# Altium project MB1261.PrjPcb (part 1 of 3)
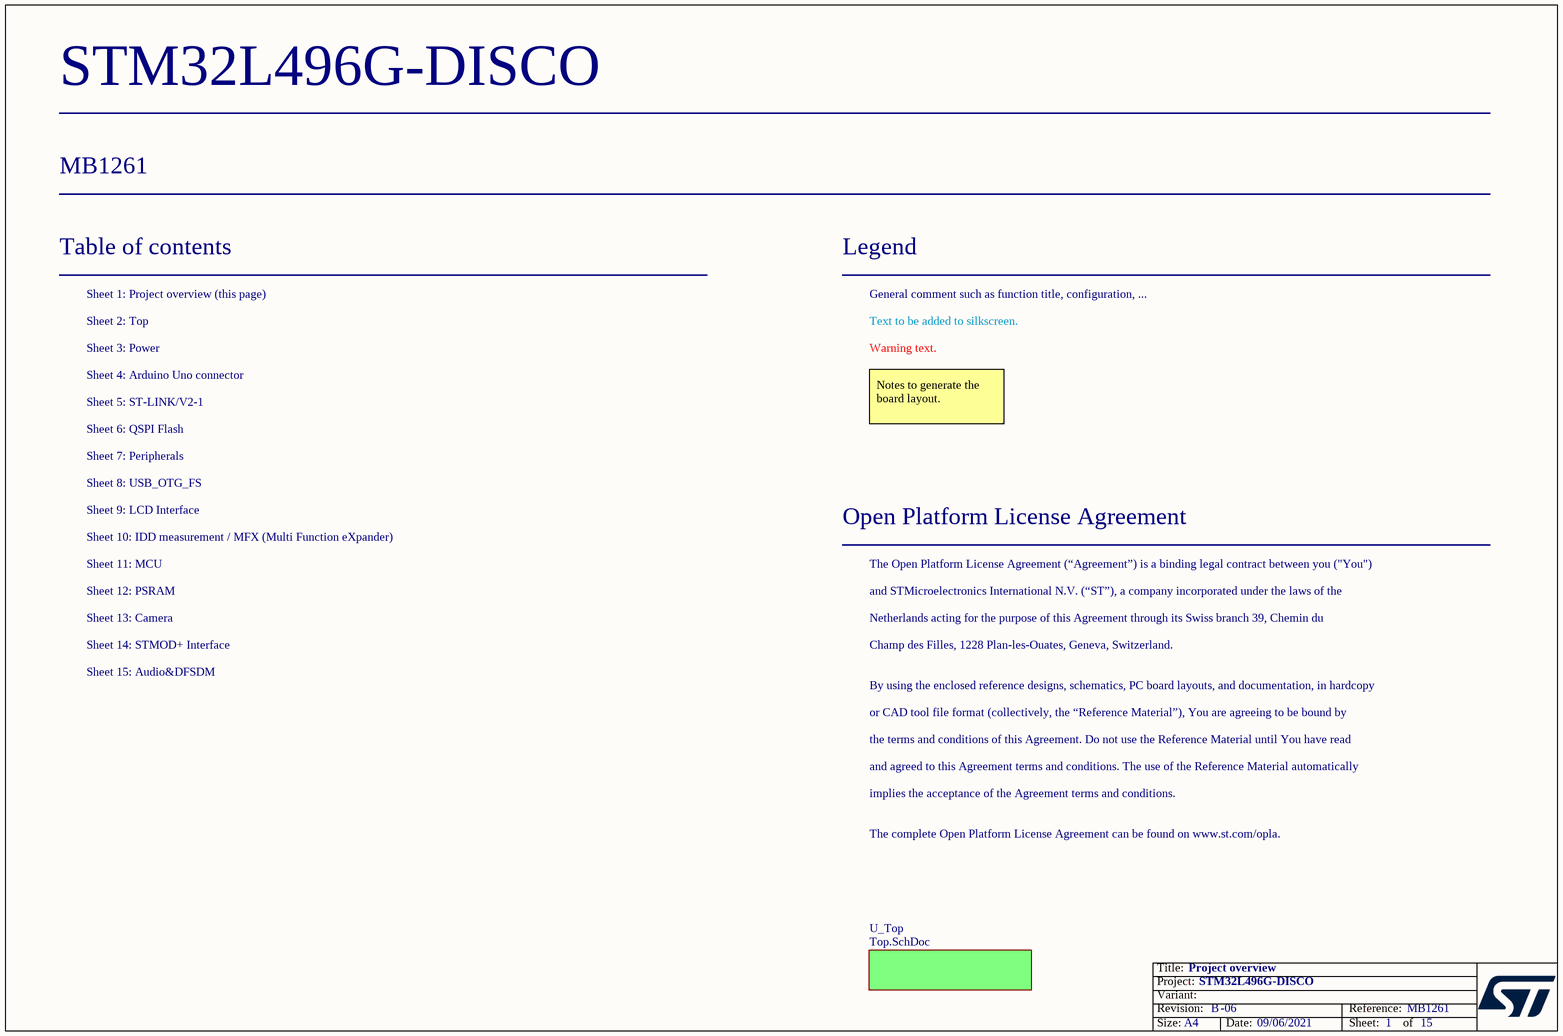
[diagram p0: Project_Overview.SchDoc]
Board_Assembly_revision: 06; Board_Document_Date: 09/06/2021; Board_name: STM32L496G-DISCO; Board_PCB_Revision: B; Board_Reference: MB1261
15 sheets, 337 parts. Net scope: flat (ports and power ports of the same name join across sheets).
Board file: MB1261.PcbDoc
Sheets:
  Project_Overview.SchDoc
    U_Top = Top.SchDoc
      Arduino_ Connectors = Arduino_ Connectors.SchDoc
      Camera Interface = Camera.SchDoc
      IDD = IDD_measurement.SchDoc
      TFT_LCD = LCD.SchDoc
      MCU = MCU.SchDoc
      Peripherals = Peripherals.SchDoc
      Power = Power.SchDoc
      PSRAM = PSRAM.SchDoc
      QSPI = QSPI.SchDoc
      ST_LINK = ST_LINK_V2-1_2.SCHDOC
      OTG = USB_OTG_FS.SchDoc
      STMOD+ = STMOD+.SchDoc
      Audio = Audio.SchDoc

## Sheet Project_Overview.SchDoc: Project overview
size A4; Date: Not used; ApprovedBy: Not used; CheckedBy: Not used; Author: Not used; CompanyName: STMicroelectronics; DrawnBy: Not used; Engineer: Not used; Organization: Not used; Address1: Not used; Address2: Not used; Address3: Not used; Address4: Not used; DocumentNumber: Not used; Revision: Not used; SheetNumber: 1; SheetTotal: 15; CurrentTime: Not used; CurrentDate: Not used; Time: Not used; DocumentFullPathAndName: Not used; DocumentName: Not used; ModifiedDate: Not used; ImagePath: Not used; ProjectName: Not used; Application_BuildNumber: Not used

### Sub-sheets
U_Top = Top.SchDoc: no entries

### Notes on the sheet
- Table of contents
- Sheet 1: Project overview (this page)
- Legend
- General comment such as function title, configuration, ...
- Sheet 2: Top
- Sheet 3: Power
- Sheet 4: Arduino Uno connector
- Text to be added to silkscreen.
- Warning text.
- Sheet 6: QSPI Flash
- Sheet 5: ST-LINK/V2-1
- Notes to generate the board layout.
- Sheet 7: Peripherals
- Sheet 9: LCD Interface
- Sheet 8: USB_OTG_FS
- Sheet 10: IDD measurement / MFX (Multi Function eXpander)
- Sheet 11: MCU
- Open Platform License Agreement
- The Open Platform License Agreement (“Agreement”) is a binding legal contract between you ("You")
- Sheet 12: PSRAM
- Sheet 13: Camera
- Sheet 14: STMOD+ Interface
- and STMicroelectronics International N.V. (“ST”), a company incorporated under the laws of the
- Netherlands acting for the purpose of this Agreement through its Swiss branch 39, Chemin du
- Champ des Filles, 1228 Plan-les-Ouates, Geneva, Switzerland.
- Sheet 15: Audio&DFSDM
- By using the enclosed reference designs, schematics, PC board layouts, and documentation, in hardcopy
- or CAD tool file format (collectively, the “Reference Material”), You are agreeing to be bound by
- the terms and conditions of this Agreement. Do not use the Reference Material until You have read
- and agreed to this Agreement terms and conditions. The use of the Reference Material automatically
- implies the acceptance of the Agreement terms and conditions.
- The complete Open Platform License Agreement can be found on www.st.com/opla.
- Title:
- Project:
- Size:
- Revision:
- Variant:
- A4
- -
- Date:
- Reference:
- Sheet:
- of

## Sheet Top.SchDoc: TOP
size A3; Author: P.A.; CompanyName: STMicroelectronics; Organization: Microcontrollers Division; Address1: 12, Rue Jules HOROWITZ; Address2: 38019 Grenoble; Address3: FRANCE; DocumentNumber: MB1261; Revision: B.01; SheetNumber: 2; SheetTotal: 15; Project: STM32L496G-DISCO
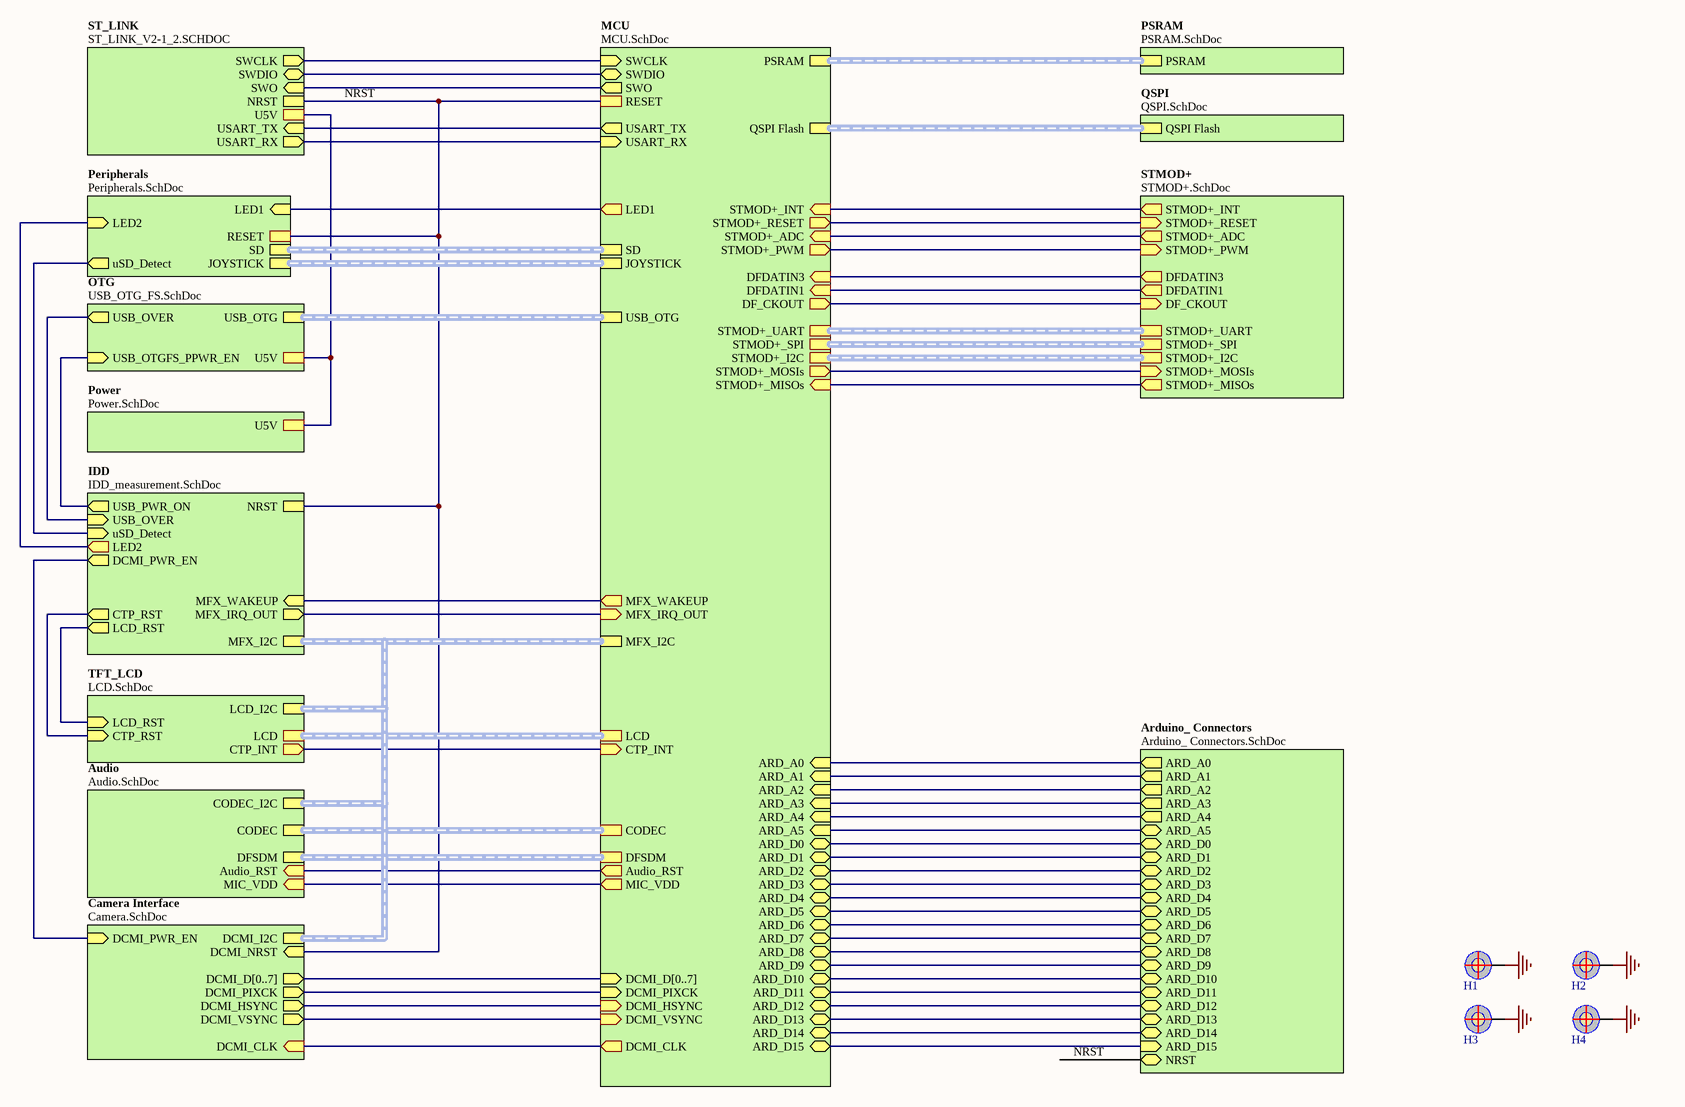
[diagram p1: Top.SchDoc]

### Parts
H1  POSITION HOLE  [Hole_C7d3r5]  (value not drawn)
H2  POSITION HOLE  [Hole_C7d3r5]  (value not drawn)
H3  POSITION HOLE  [Hole_C7d3r5]  (value not drawn)
H4  POSITION HOLE  [Hole_C7d3r5]  (value not drawn)

### Sub-sheets
Arduino_ Connectors = Arduino_ Connectors.SchDoc: NRST (bidir), ARD_A0 (out), ARD_A1 (out), ARD_A2 (out), ARD_A3 (out), ARD_A4 (out), ARD_A5 (bidir), ARD_D5 (bidir), ARD_D4 (bidir), ARD_D3 (bidir), ARD_D2 (bidir), ARD_D1 (bidir), ARD_D0 (bidir), ARD_D13 (bidir), ARD_D12 (bidir), ARD_D11 (bidir), ARD_D10 (bidir), ARD_D9 (bidir), ARD_D8 (bidir), ARD_D6 (bidir), ARD_D7 (bidir), ARD_D15 (in), ARD_D14 (bidir)
Audio = Audio.SchDoc: CODEC (harness SAI), CODEC_I2C (harness I2C), DFSDM (harness DFSDM), MIC_VDD (in), Audio_RST (in)
Camera Interface = Camera.SchDoc: DCMI_D[0..7] (out), DCMI_NRST (in), DCMI_PWR_EN (in), DCMI_VSYNC (out), DCMI_HSYNC (out), DCMI_PIXCK (out), DCMI_I2C (harness I2C), DCMI_CLK (in)
IDD = IDD_measurement.SchDoc: MFX_IRQ_OUT (out), MFX_WAKEUP (in), NRST, MFX_I2C (harness I2C), USB_PWR_ON (out), DCMI_PWR_EN (out), uSD_Detect (in), USB_OVER (in), CTP_RST (out), LCD_RST (out), LED2 (out)
MCU = MCU.SchDoc: QSPI Flash (harness QSPI), PSRAM (harness PSRAM), SD (harness SD), JOYSTICK (harness JOYSTICK), USB_OTG (harness USB_OTG), MFX_IRQ_OUT (in), MFX_WAKEUP (out), ARD_A0 (in), MFX_I2C (harness I2C), ARD_A1 (in), ARD_A2 (in), ARD_A3 (in), ARD_A4 (in), ARD_A5 (in), ARD_D0 (bidir), ARD_D1 (bidir), ARD_D2 (bidir), ARD_D3 (bidir), ARD_D4 (bidir), ARD_D5 (bidir), ARD_D6 (bidir), ARD_D7 (bidir), ARD_D8 (bidir), ARD_D9 (bidir), ARD_D10 (bidir), ARD_D11 (bidir), ARD_D12 (bidir), ARD_D13 (bidir), ARD_D14 (bidir), ARD_D15 (bidir), USART_TX (out), USART_RX (in), SWCLK (in), SWDIO (bidir), SWO (out), DCMI_D[0..7] (in), DCMI_VSYNC (in), DCMI_HSYNC (in), DCMI_PIXCK (in), STMOD+_UART (harness UART), STMOD+_I2C (harness I2C), STMOD+_INT (in), STMOD+_RESET (out), STMOD+_ADC (in), STMOD+_PWM (out), STMOD+_MOSIs (out), STMOD+_MISOs (in), STMOD+_SPI (harness SPI), DFDATIN3 (in), DFDATIN1 (in), DFSDM (harness DFSDM), MIC_VDD (out), CODEC (harness SAI), LED1 (out), RESET, DCMI_CLK (out), LCD (harness LCD), CTP_INT (in), DF_CKOUT (out), Audio_RST (out)
OTG = USB_OTG_FS.SchDoc: USB_OTG (harness USB_OTG), USB_OTGFS_PPWR_EN (in), USB_OVER (out), U5V
Peripherals = Peripherals.SchDoc: LED1 (in), SD (harness SD), JOYSTICK (harness JOYSTICK), LED2 (in), uSD_Detect (out), RESET
Power = Power.SchDoc: U5V
PSRAM = PSRAM.SchDoc: PSRAM (harness PSRAM)
QSPI = QSPI.SchDoc: QSPI Flash (harness QSPI)
ST_LINK = ST_LINK_V2-1_2.SCHDOC: NRST, SWCLK (out), SWDIO (bidir), SWO (in), USART_TX (in), USART_RX (out), U5V
STMOD+ = STMOD+.SchDoc: STMOD+_INT (out), STMOD+_RESET (in), STMOD+_ADC (out), DFDATIN3 (out), STMOD+_PWM (in), DFDATIN1 (out), STMOD+_UART (harness UART), STMOD+_SPI (harness SPI), STMOD+_I2C (harness I2C), STMOD+_MOSIs (in), STMOD+_MISOs (out), DF_CKOUT (in)
TFT_LCD = LCD.SchDoc: LCD_I2C (harness I2C), CTP_RST (in), LCD_RST (in), LCD (harness LCD), CTP_INT (out)

### Nets
GND: H1.1 H2.1 H3.1 H4.1
NRST: sheet Arduino_ Connectors/NRST, sheet Camera Interface/DCMI_NRST, sheet IDD/NRST, sheet MCU/RESET, sheet Peripherals/RESET, sheet ST_LINK/NRST
(unnamed): sheet Arduino_ Connectors/ARD_A0, sheet MCU/ARD_A0
(unnamed): sheet Arduino_ Connectors/ARD_A1, sheet MCU/ARD_A1
(unnamed): sheet Arduino_ Connectors/ARD_A2, sheet MCU/ARD_A2
(unnamed): sheet Arduino_ Connectors/ARD_A3, sheet MCU/ARD_A3
(unnamed): sheet Arduino_ Connectors/ARD_A4, sheet MCU/ARD_A4
(unnamed): sheet Arduino_ Connectors/ARD_A5, sheet MCU/ARD_A5
(unnamed): sheet Arduino_ Connectors/ARD_D5, sheet MCU/ARD_D5
(unnamed): sheet Arduino_ Connectors/ARD_D4, sheet MCU/ARD_D4
(unnamed): sheet Arduino_ Connectors/ARD_D3, sheet MCU/ARD_D3
(unnamed): sheet Arduino_ Connectors/ARD_D2, sheet MCU/ARD_D2
(unnamed): sheet Arduino_ Connectors/ARD_D1, sheet MCU/ARD_D1
(unnamed): sheet Arduino_ Connectors/ARD_D0, sheet MCU/ARD_D0
(unnamed): sheet Arduino_ Connectors/ARD_D13, sheet MCU/ARD_D13
(unnamed): sheet Arduino_ Connectors/ARD_D12, sheet MCU/ARD_D12
(unnamed): sheet Arduino_ Connectors/ARD_D11, sheet MCU/ARD_D11
(unnamed): sheet Arduino_ Connectors/ARD_D10, sheet MCU/ARD_D10
(unnamed): sheet Arduino_ Connectors/ARD_D9, sheet MCU/ARD_D9
(unnamed): sheet Arduino_ Connectors/ARD_D8, sheet MCU/ARD_D8
(unnamed): sheet Arduino_ Connectors/ARD_D6, sheet MCU/ARD_D6
(unnamed): sheet Arduino_ Connectors/ARD_D7, sheet MCU/ARD_D7
(unnamed): sheet Arduino_ Connectors/ARD_D15, sheet MCU/ARD_D15
(unnamed): sheet Arduino_ Connectors/ARD_D14, sheet MCU/ARD_D14
(unnamed): sheet Camera Interface/DCMI_PWR_EN, sheet IDD/DCMI_PWR_EN
(unnamed): sheet Camera Interface/DCMI_VSYNC, sheet MCU/DCMI_VSYNC
(unnamed): sheet Camera Interface/DCMI_HSYNC, sheet MCU/DCMI_HSYNC
(unnamed): sheet Camera Interface/DCMI_PIXCK, sheet MCU/DCMI_PIXCK
(unnamed): sheet Camera Interface/DCMI_CLK, sheet MCU/DCMI_CLK
(unnamed): sheet IDD/MFX_IRQ_OUT, sheet MCU/MFX_IRQ_OUT
(unnamed): sheet IDD/MFX_WAKEUP, sheet MCU/MFX_WAKEUP
(unnamed): sheet IDD/USB_PWR_ON, sheet OTG/USB_OTGFS_PPWR_EN
(unnamed): sheet IDD/uSD_Detect, sheet Peripherals/uSD_Detect
(unnamed): sheet IDD/USB_OVER, sheet OTG/USB_OVER
(unnamed): sheet IDD/CTP_RST, sheet TFT_LCD/CTP_RST
(unnamed): sheet IDD/LCD_RST, sheet TFT_LCD/LCD_RST
(unnamed): sheet IDD/LED2, sheet Peripherals/LED2
(unnamed): sheet TFT_LCD/CTP_INT, sheet MCU/CTP_INT
(unnamed): sheet MCU/USART_TX, sheet ST_LINK/USART_TX
(unnamed): sheet MCU/USART_RX, sheet ST_LINK/USART_RX
(unnamed): sheet MCU/SWCLK, sheet ST_LINK/SWCLK
(unnamed): sheet MCU/SWDIO, sheet ST_LINK/SWDIO
(unnamed): sheet MCU/SWO, sheet ST_LINK/SWO
(unnamed): sheet MCU/STMOD+_INT, sheet STMOD+/STMOD+_INT
(unnamed): sheet MCU/STMOD+_RESET, sheet STMOD+/STMOD+_RESET
(unnamed): sheet MCU/STMOD+_ADC, sheet STMOD+/STMOD+_ADC
(unnamed): sheet MCU/STMOD+_PWM, sheet STMOD+/STMOD+_PWM
(unnamed): sheet MCU/STMOD+_MOSIs, sheet STMOD+/STMOD+_MOSIs
(unnamed): sheet MCU/STMOD+_MISOs, sheet STMOD+/STMOD+_MISOs
(unnamed): sheet MCU/DFDATIN3, sheet STMOD+/DFDATIN3
(unnamed): sheet MCU/DFDATIN1, sheet STMOD+/DFDATIN1
(unnamed): sheet MCU/MIC_VDD, sheet Audio/MIC_VDD
(unnamed): sheet MCU/LED1, sheet Peripherals/LED1
(unnamed): sheet MCU/DF_CKOUT, sheet STMOD+/DF_CKOUT
(unnamed): sheet MCU/Audio_RST, sheet Audio/Audio_RST
(unnamed): sheet Power/U5V, sheet ST_LINK/U5V, sheet OTG/U5V

### Buses and harness runs
bus sheet Camera Interface/DCMI_D[0..7] = sheet MCU/DCMI_D[0..7]
harness sheet Audio/CODEC = sheet MCU/CODEC
harness sheet Audio/CODEC_I2C = sheet Camera Interface/DCMI_I2C = sheet IDD/MFX_I2C = sheet MCU/MFX_I2C = sheet TFT_LCD/LCD_I2C
harness sheet Audio/DFSDM = sheet MCU/DFSDM
harness sheet MCU/JOYSTICK = sheet Peripherals/JOYSTICK
harness sheet MCU/LCD = sheet TFT_LCD/LCD
harness sheet MCU/PSRAM = sheet PSRAM/PSRAM
harness sheet MCU/QSPI Flash = sheet QSPI/QSPI Flash
harness sheet MCU/SD = sheet Peripherals/SD
harness sheet MCU/STMOD+_I2C = sheet STMOD+/STMOD+_I2C
harness sheet MCU/STMOD+_SPI = sheet STMOD+/STMOD+_SPI
harness sheet MCU/STMOD+_UART = sheet STMOD+/STMOD+_UART
harness sheet MCU/USB_OTG = sheet OTG/USB_OTG

### Notes on the sheet
- Title:
- Project:
- Size:
- Revision:
- Variant:
- A3
- -
- Date:
- Reference:
- Sheet:
- of

## Sheet Arduino_ Connectors.SchDoc: Arduino Uno connector
size A4; Author: P.A.; CompanyName: STMicroelectronics; Organization: Microcontrollers Division; Address1: 12, Rue Jules HOROWITZ; Address2: 38019 Grenoble; Address3: FRANCE; DocumentNumber: MB1261; Revision: B.01; SheetNumber: 4; SheetTotal: 15; Project: STM32L496G-DISCO
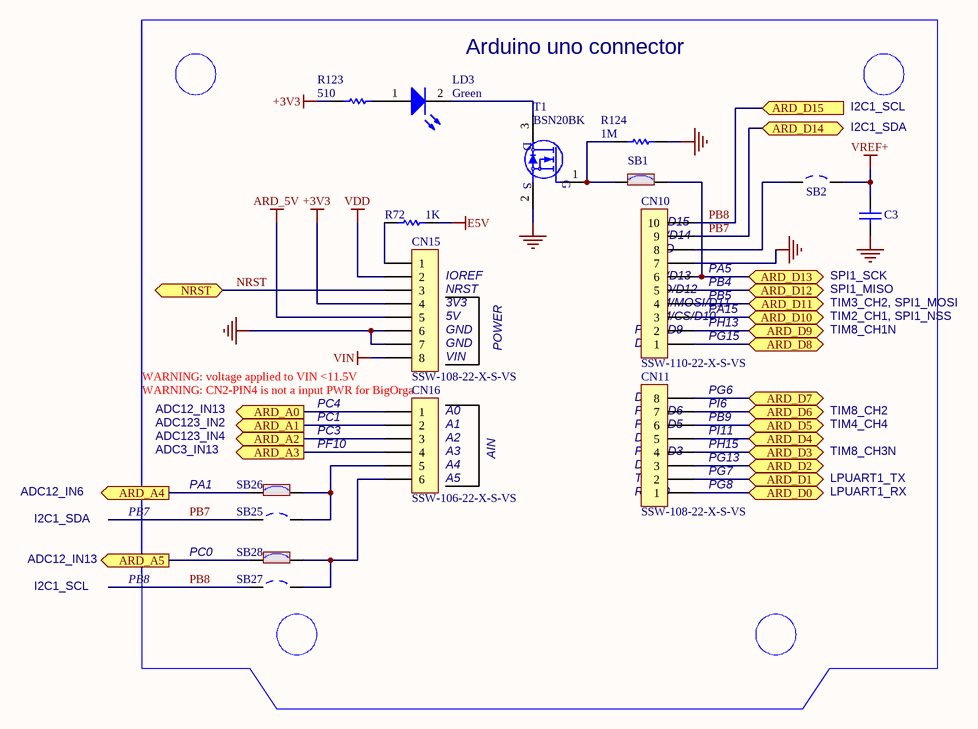
[diagram p2: Arduino_ Connectors.SchDoc]

### Parts
C3  (no value)  [0603C]
CN10  SSW-110-22-X-S-VS  [SSW-110-22-X-S-VS]
CN11  SSW-108-22-X-S-VS  [SSW-108-22-X-S-VS]
CN15  SSW-108-22-X-S-VS  [SSW-108-22-X-S-VS]
CN16  SSW-106-22-X-S-VS  [SSW-106-22-X-S-VS]
LD3  Corlor: Green  [0603D]  (hidden comment: 19-213SY6C/S530-E2/TR8LED)
R72  1K  [0603R]
R123  value 510  [0603R]  (hidden comment: RC0603JR-07510RL)
R124  1M  [0603R]
SB1  Solder Bridge ON  [SB_0603]  (value not drawn)
SB2  Solder Bridge OFF  [SB_0603]  (value not drawn)
SB25  Solder Bridge OFF  [SB_0603]  (value not drawn)
SB26  Solder Bridge ON  [SB_0603]  (value not drawn)
SB27  Solder Bridge OFF  [SB_0603]  (value not drawn)
SB28  Solder Bridge ON  [SB_0603]  (value not drawn)
T1  BSN20BK  [SOT-23]

### Ports
ARD_A0 (out), ARD_A1 (out), ARD_A2 (out), ARD_A3 (out), ARD_A4 (out), ARD_A5 (out), ARD_D0 (bidir), ARD_D1 (bidir), ARD_D2 (bidir), ARD_D3 (bidir), ARD_D4 (bidir), ARD_D5 (bidir), ARD_D6 (bidir), ARD_D7 (bidir), ARD_D8 (bidir), ARD_D9 (bidir), ARD_D10 (bidir), ARD_D11 (bidir), ARD_D12 (bidir), ARD_D13 (bidir), ARD_D14 (bidir), ARD_D15 (in), NRST (bidir)

### Nets
+3V3: CN15.4 R123.1  [project net 3V3_OUT]
ARD_5V: CN15.5
E5V: R72.1
GND: C3.2 CN10.7 CN15.6 CN15.7 R124.2 T1.2(S)
VDD: CN15.2
VIN: CN15.8
VREF+: C3.1 SB2.2
ARD_A0: CN16.1 ; port ARD_A0
ARD_A1: CN16.2 ; port ARD_A1
ARD_A2: CN16.3 ; port ARD_A2
ARD_A3: CN16.4 ; port ARD_A3
ARD_A4: SB26.1 ; port ARD_A4
ARD_A5: SB28.1 ; port ARD_A5
ARD_D0: CN11.1 ; port ARD_D0
ARD_D1: CN11.2 ; port ARD_D1
ARD_D2: CN11.3 ; port ARD_D2
ARD_D3: CN11.4 ; port ARD_D3
ARD_D4: CN11.5 ; port ARD_D4
ARD_D5: CN11.6 ; port ARD_D5
ARD_D6: CN11.7 ; port ARD_D6
ARD_D7: CN11.8 ; port ARD_D7
ARD_D8: CN10.1 ; port ARD_D8
ARD_D9: CN10.2 ; port ARD_D9
ARD_D10: CN10.3 ; port ARD_D10
ARD_D11: CN10.4 ; port ARD_D11
ARD_D12: CN10.5 ; port ARD_D12
ARD_D13: CN10.6 SB1.2 ; port ARD_D13
NRST: CN15.3 ; port NRST
PB7: CN10.9 SB25.1 ; port ARD_D14  [project net ARD_D14]
PB8: CN10.10 SB27.1 ; port ARD_D15  [project net ARD_D15]
NetCN10_8: CN10.8 SB2.1
NetCN15_1: CN15.1 R72.2
NetCN16_5: CN16.5 SB25.2 SB26.2
NetCN16_6: CN16.6 SB27.2 SB28.2
NetLD3_1: LD3.1(A) R123.2
NetLD3_2: LD3.2(K) T1.3(D)
NetR124_1: R124.1 SB1.1 T1.1(G)

### Notes on the sheet
- Arduino uno connector
- I2C1_SCL
- I2C1_SDA
- (near CN10) SDA/D14
- SCL/D15
- (near CN10) AVDD
- IOREF
- (near CN15) NRST
- (near CN15) 3V3
- (near CN10) SCK/D13
- (near CN10) MISO/D12
- (near CN10) PWM/MOSI/D11
- (near CN10) GND
- (near CN10) PA15
- (near CN10) PB5
- (near CN10) PB4
- (near CN10) PA5
- TIM3_CH2, SPI1_MOSI
- SPI1_MISO
- (near C3) SPI1_SCK
- WARNING: voltage applied to VIN <11.5V
- (near CN15) 5V
- (near CN15) GND
- (near CN15) VIN
- POWER
- (near CN10) D8
- (near CN10) PWM/D9
- (near CN10) PWM/CS/D10
- (near CN10) PG15
- (near CN10) PH13
- TIM8_CH1N
- TIM2_CH1, SPI1_NSS
- (near CN16) WARNING: CN2-PIN4 is not a input PWR for BigOrga
- ADC3_IN13
- ADC123_IN4
- ADC123_IN2
- ADC12_IN13
- PC4
- PC1
- PC3
- PF10
- (near CN16) A0
- (near CN16) A1
- (near CN16) A2
- (near CN11) D4
- (near CN11) PWM/D5
- (near CN11) PWM/D6
- (near CN11) D7
- (near CN11) PI11
- (near CN11) PB9
- (near CN11) PI6
- PG6
- (near CN11) PH15
- TIM4_CH4
- TIM8_CH2
- ADC12_IN6
- PB7
- PA1
- (near CN16) A3
- (near CN16) A4
- (near CN16) A5
- AIN
- (near CN11) RX/D0
- (near CN11) TX/D1
- (near CN11) D2
- (near CN11) PWM/D3
- (near CN11) PG7
- (near CN11) PG8
- (near CN11) PG13
- LPUART1_TX
- LPUART1_RX
- TIM8_CH3N
- PB8
- PC0
- Title:
- Project:
- Size:
- Revision:
- Variant:
- -
- Date:
- Reference:
- Sheet:
- of

### Library data of the parts
C3 = Cap: Capacitor,100nF,10%,16V,X7R,0603,YAGEO; Manuf_Part_1: CC0603KRX7R7BB104; Ordered by: Subcon; Published: 8-Jun-2000; Revision: July-2002: Re-released for DXP Platform.; Publisher: Altium Limited; Value: 100nF; Manuf_1: YAGEO
CN10 = Header 10X1_Female: Header, 10-Pin, Single row,female; Manuf_1: SAMTEC; Ordered by: Subcon; ECCN_US/EU: NA; LatestRevisionDate: 17-Jul-2002; LatestRevisionNote: Re-released for DXP Platform.; Publisher: Altium Limited; Manuf_Part_1: SSW-110-22-X-S-VS
CN11 CN15 = Header 8X1_Female: Header, 8-Pin, Single row,female; Manuf_1: SAMTEC; Ordered by: Subcon; ECCN_US/EU: NA; LatestRevisionDate: 17-Jul-2002; LatestRevisionNote: Re-released for DXP Platform.; Publisher: Altium Limited; Manuf_Part_1: SSW-108-22-X-S-VS
CN16 = Header 6X1_Female: Header, 6-Pin, Single row,female; Manuf_1: SAMTEC; Ordered by: Subcon; ECCN_US/EU: NA; LatestRevisionDate: 17-Jul-2002; LatestRevisionNote: Re-released for DXP Platform.; Publisher: Altium Limited; Manuf_Part_1: SSW-106-22-X-S-VS
LD3 = LED2: LED,Green,0603; Manuf_1: Everlight; Ordered by: Subcon; ECCN_US/EU: EAR99/NEC; Published: 8-Jun-2000; Revision: July-2002: Re-released for DXP Platform.; Publisher: Altium Limited; Manuf_Part_1: 19-213SY6C/S530-E2/TR8LED
R72 = res1: Resistor,1K,0603,1%; Manuf_1: YAGEO; Manuf_Part_1: RC0603FR-071KL; Ordered by: Subcon; ECCN_US/EU: NA; Published: 8-Jun-2000; Revision: July-2002: Re-released for DXP Platform.; Publisher: Altium Limited; Value: 1K
R123 = res1: Resistor, 510R , 0603,1%,YAGEO; Ordered by: Subcon; ECCN_US/EU: NA; Published: 8-Jun-2000; Revision: July-2002: Re-released for DXP Platform.; Publisher: Altium Limited; Manuf_1: YAGEO; Manuf_Part_1: RC0603JR-07510RL
R124 = res1: Resistor, 1M , 0603; Ordered by: Subcon; ECCN_US/EU: NA; Published: 8-Jun-2000; Revision: July-2002: Re-released for DXP Platform.; Publisher: Altium Limited; Value: 1M
SB1 SB26 SB28 = SB_ON: Manuf_1: YAGEO; Manuf_Part_1: RC0603JR-070RL; Solder: YES; Ordered By: Subcon; Revision: July-2002: Re-released for DXP Platform.; ECCN_US/EU: N/A
SB2 SB25 SB27 = SB_OFF: Solder: NO; Revision: July-2002: Re-released for DXP Platform.; ECCN_US/EU: N/A
T1 = 2N7000: Manuf_1: NXP; Ordered by: Subcon; Manuf_Part_1: BSN20BK; ECCN_US/EU: N/A

## Sheet Camera.SchDoc: Camera
size A4; Author: P.A.; CompanyName: STMicroelectronics; Organization: Microcontrollers Division; Address1: 12, Rue Jules HOROWITZ; Address2: 38019 Grenoble; Address3: FRANCE; DocumentNumber: MB1261; Revision: B.01; SheetNumber: 13; SheetTotal: 15; Project: STM32L496G-DISCO
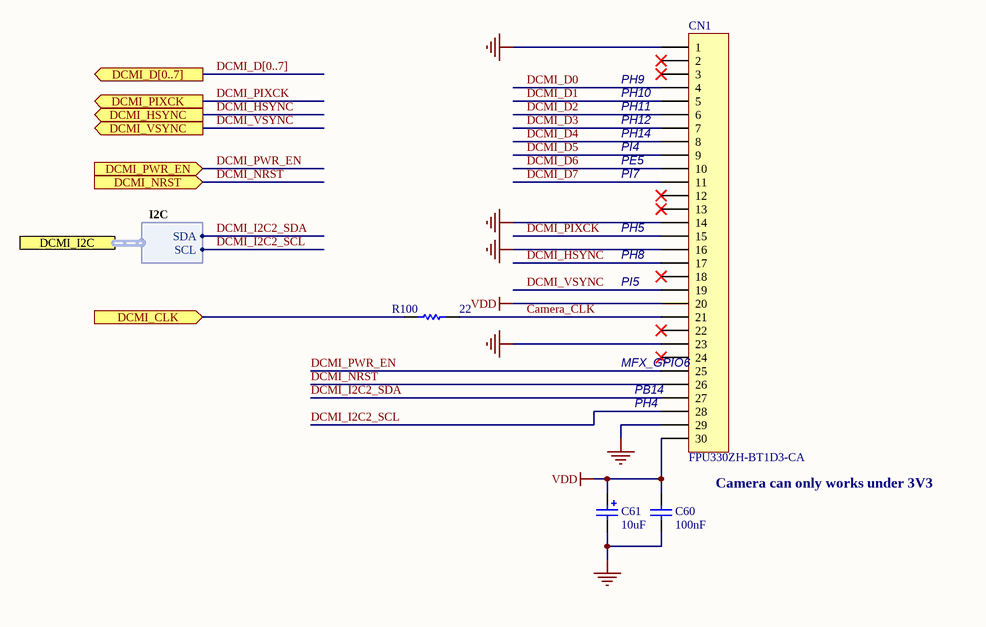
[diagram p3: Camera.SchDoc]

### Parts
C60  value 100nF  [0603C]  (hidden comment: CC0603KRX7R7BB104)
C61  value 10uF  [TAN-A]  (hidden comment: TAJA106K016R)
CN1  FPU330ZH-BT1D3-CA  [FPU330ZH-BT1D3-CA]
R100  value 22  [0603R]  (hidden comment: RC0603JR-0722RL)

### Ports
DCMI_CLK (in), DCMI_D[0..7] (out), DCMI_HSYNC (out), DCMI_I2C (harness I2C), DCMI_NRST (in), DCMI_PIXCK (out), DCMI_PWR_EN (in), DCMI_VSYNC (out)

### Harnesses
I2C: SDA, SCL

### Nets
GND: C60.2 C61.2 CN1.1 CN1.14 CN1.16 CN1.23 CN1.29
VDD: C60.1 C61.1 CN1.20 CN1.30
Camera_CLK: CN1.21 R100.1
DCMI_CLK: R100.2 ; port DCMI_CLK
DCMI_D0: CN1.4
DCMI_D1: CN1.5
DCMI_D2: CN1.6
DCMI_D3: CN1.7
DCMI_D4: CN1.8
DCMI_D5: CN1.9
DCMI_D6: CN1.10
DCMI_D7: CN1.11
DCMI_HSYNC: CN1.17 ; port DCMI_HSYNC
DCMI_I2C2_SCL: CN1.28 ; port DCMI_I2C.SCL
DCMI_I2C2_SDA: CN1.27 ; port DCMI_I2C.SDA
DCMI_NRST: CN1.26 ; port DCMI_NRST
DCMI_PIXCK: CN1.15 ; port DCMI_PIXCK
DCMI_PWR_EN: CN1.25 ; port DCMI_PWR_EN
DCMI_VSYNC: CN1.19 ; port DCMI_VSYNC

Not connected (* = marked no-connect by the designer): CN1 2* 3* 12* 13* 18* 22* 24*

### Buses and harness runs
bus DCMI_D[0..7] = port DCMI_D[0..7]

### Notes on the sheet
- (near CN1) PH10
- (near CN1) PH11
- (near CN1) PH9
- (near CN1) PE5
- (near CN1) PH12
- (near CN1) PH14
- (near CN1) PI4
- (near CN1) PI7
- (near CN1) PH5
- (near CN1) PH8
- (near CN1) PI5
- (near CN1) MFX_GPIO6
- (near CN1) PH4
- (near CN1) PB14
- Camera can only works under 3V3
- Title:
- Project:
- Size:
- Revision:
- Variant:
- A4
- -
- Date:
- Reference:
- Sheet:
- of

### Library data of the parts
C60 = Cap: Capacitor,100nF,10%,16V,X7R,0603,YAGEO; Ordered by: Subcon; Published: 8-Jun-2000; Revision: July-2002: Re-released for DXP Platform.; Publisher: Altium Limited; Manuf_1: YAGEO; Manuf_Part_1: CC0603KRX7R7BB104
C61 = Cap Pol1: TAN Capacitor,10uF,10%,16V,A Type,AVX; Ordered by: Subcon; ECCN_US/EU: NA; Published: 8-Jun-2000; Revision: July-2002: Re-released for DXP Platform.; Publisher: Altium Limited; Manuf_1: AVX; Manuf_Part_1: TAJA106K016R
CN1 = FPU330ZH-BT1D3-CA: TOWNES -  Connector FFC/FPC ZIF 0.5mm 30 pins, Lower Contacts; Manuf_Part_2: TFP-A330ZH-BT1-ECX; Ordered by: Subcon; Manuf_Part_1: FPU330ZH-BT1D3-CA; Order: *; Manuf_1: TOWNES; Distrib: Sub Co; ECCN_US/EU: n/a; Manuf_2: TOWNES
R100 = res1: Resistor, 22 ,0603,1%,YAGEO; Ordered by: Subcon; ECCN_US/EU: NA; Published: 8-Jun-2000; Revision: July-2002: Re-released for DXP Platform.; Publisher: Altium Limited; Manuf_1: YAGEO; Manuf_Part_1: RC0603JR-0722RL

## Sheet IDD_measurement.SchDoc: IDD measurement / MFX (Multi Function eXpander)
size A3; Date: 3/31/2015; Author: P.A.; CompanyName: STMicroelectronics; Organization: Microcontrollers Division; Address1: 12, Rue Jules HOROWITZ; Address2: 38019 Grenoble; Address3: FRANCE; DocumentNumber: MB1261; Revision: B.01; SheetNumber: 10; SheetTotal: 15; Project: STM32L496G-DISCO
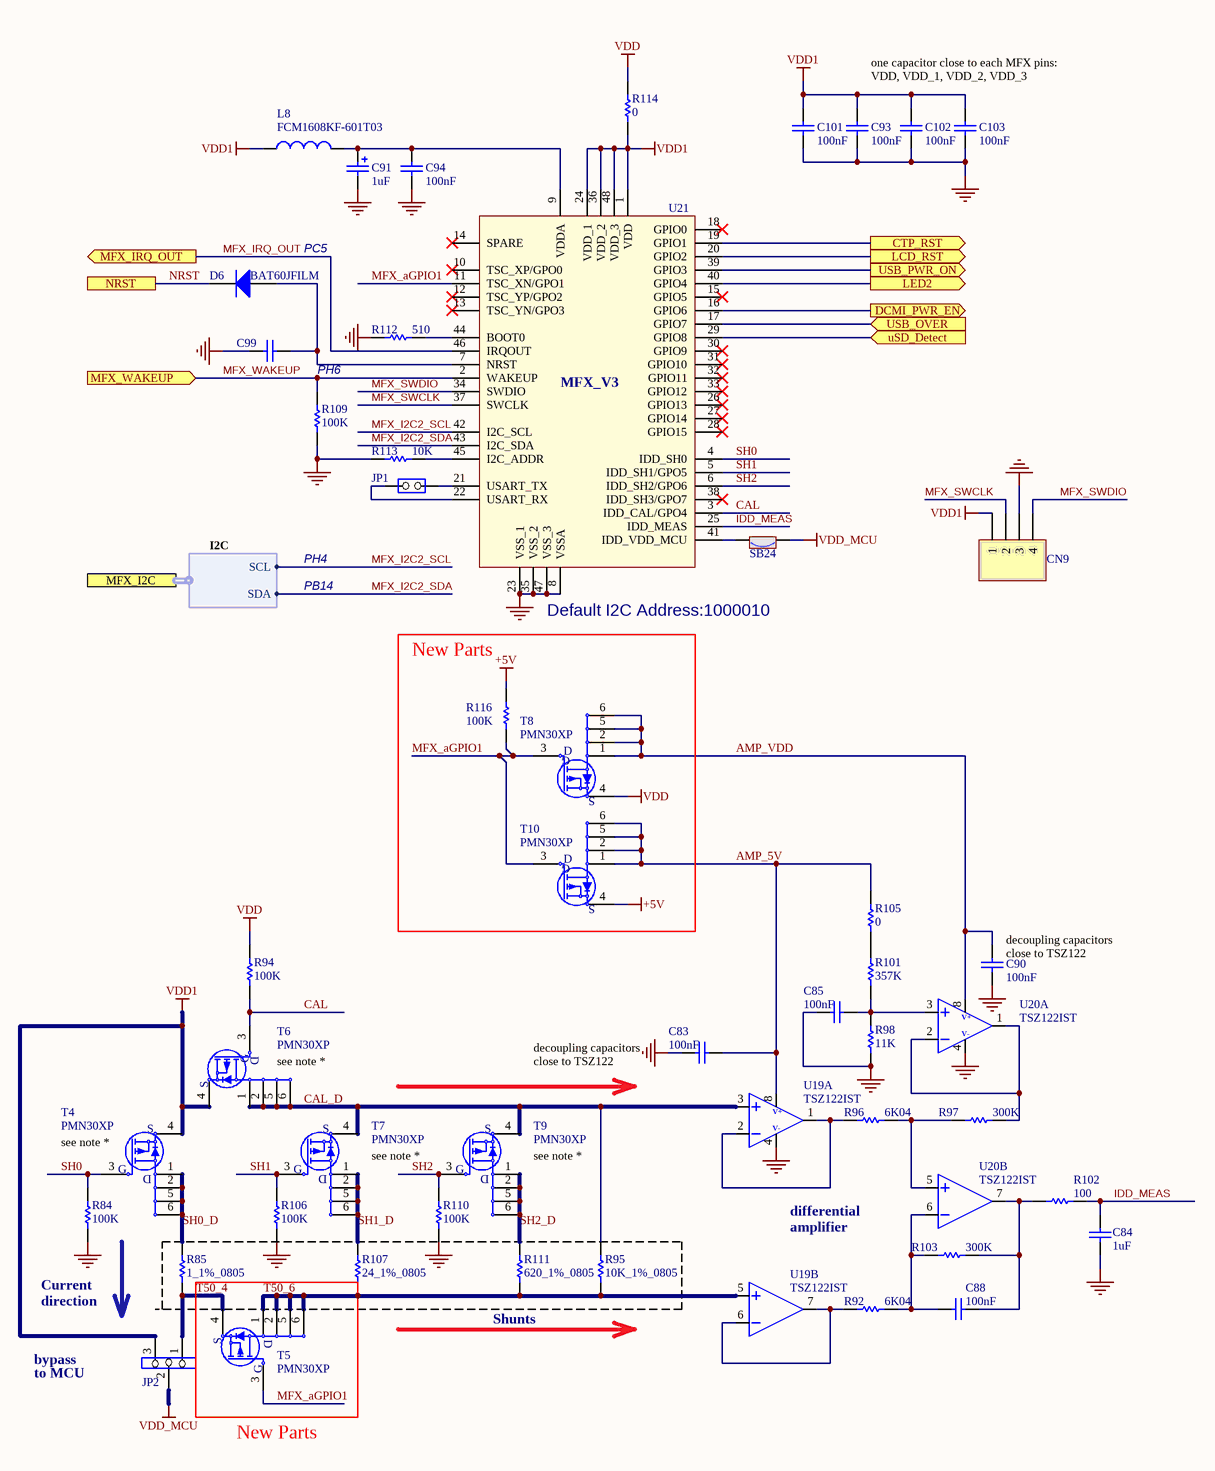
[diagram p4: IDD_measurement.SchDoc]

### Parts
C83  value 100nF  [0603C]  (hidden comment: CC0603KRX7R7BB104)
C84  value 1uF  [0603C]  (hidden comment: CC0603KRX5R7BB105)
C85  value 100nF  [0603C]  (hidden comment: CC0603KRX7R7BB104)
C88  value 100nF  [0603C]  (hidden comment: CC0603KRX7R7BB104)
C90  value 100nF  [0603C]  (hidden comment: CC0603KRX7R7BB104)
C91  value 1uF  [TAN-A]  (hidden comment: TAJA105K016R)
C93  value 100nF  [0603C]  (hidden comment: CC0603KRX7R7BB104)
C94  value 100nF  [0603C]  (hidden comment: CC0603KRX7R7BB104)
C99  (no value)  [0603C]
C101  value 100nF  [0603C]  (hidden comment: CC0603KRX7R7BB104)
C102  value 100nF  [0603C]  (hidden comment: CC0603KRX7R7BB104)
C103  value 100nF  [0603C]  (hidden comment: CC0603KRX7R7BB104)
CN9  (no value)  [HDR_1X4_2R54]
D6  BAT60JFILM  [SOD-323]
JP1  (no value)  [SIP2]
JP2  3 PIN Jumper  [SIP3]  (value not drawn)
L8  FCM1608KF-601T03  [0603L]
R84  value 100K  [0603R]  (hidden comment: RC0603FR-07100KL)
R85  1_1%_0805  [0805R]
R92  value 6K04  [0603R]  (hidden comment: RC0603FR-076K04L)
R94  value 100K  [0603R]  (hidden comment: RC0603FR-07100KL)
R95  10K_1%_0805  [0805R]
R96  value 6K04  [0603R]  (hidden comment: RC0603FR-076K04L)
R97  value 300K  [0603R]  (hidden comment: RC0603FR-07300KL)
R98  value 11K  [0603R]  (hidden comment: RC0603FR-0711KL)
R101  value 357K  [0603R]  (hidden comment: RC0603FR-07357KL)
R102  value 100  [0603R]  (hidden comment: RC0603JR-07100RL)
R103  value 300K  [0603R]  (hidden comment: RC0603FR-07300KL)
R105  value 0  [0603R]  (hidden comment: RC0603JR-070RL)
R106  value 100K  [0603R]  (hidden comment: RC0603FR-07100KL)
R107  24_1%_0805  [0805R]
R109  value 100K  [0603R]  (hidden comment: RC0603FR-07100KL)
R110  value 100K  [0603R]  (hidden comment: RC0603FR-07100KL)
R111  620_1%_0805  [0805R]
R112  value 510  [0603R]  (hidden comment: RC0603FR-07510RL)
R113  value 10K  [0603R]  (hidden comment: RC0603FR-0710KL)
R114  value 0  [0603R]  (hidden comment: RC0603JR-070RL)
R116  value 100K  [0603R]  (hidden comment: RC0603FR-07100KL)
SB24  Solder Bridge ON  [SB_0603]  (value not drawn)
T4  PMN30XP  [MOS_SOT23-6L]
T5  PMN30XP  [MOS_SOT23-6L]
T6  PMN30XP  [MOS_SOT23-6L]
T7  PMN30XP  [MOS_SOT23-6L]
T8  PMN30XP  [MOS_SOT23-6L]
T9  PMN30XP  [MOS_SOT23-6L]
T10  PMN30XP  [MOS_SOT23-6L]
U19  TSZ122IST  [miniSO8]  (parts A,B of 2)
U20  TSZ122IST  [miniSO8]  (parts A,B of 2)
U21  STM32L152CCT6  [LQFP48_0R5_9X9]  (value not drawn)

### Blocks framed on the sheet
New Parts: R116 T8 T10

### Ports
CTP_RST (out), DCMI_PWR_EN (out), LCD_RST (out), LED2 (out), MFX_I2C (harness I2C), MFX_IRQ_OUT (out), MFX_WAKEUP (in), NRST, USB_OVER (in), USB_PWR_ON (out), uSD_Detect (in)

### Harnesses
I2C: SDA, SCL

### Nets
+5V: R116.2 T10.4(S)
GND: C83.1 C84.2 C85.1 C90.2 C91.2 C93.2 C94.2 C99.1 C101.2 C102.2 C103.2 CN9.3 R84.1 R98.2 R106.1 R109.1 R110.1 R112.2 R113.2 U19.4 U20.4 U21.8(VSSA) U21.23(VSS_1) U21.35(VSS_2) U21.47(VSS_3)
VDD: R94.2 R114.1 T8.4(S)
VDD1: C93.1 C101.1 C102.1 C103.1 CN9.1 JP2.3 L8.1 R114.2 T4.4(S) T6.4(S) U21.1(VDD) U21.24(VDD_1) U21.36(VDD_2) U21.48(VDD_3)
VDD_MCU: JP2.2 SB24.1
AMP_5V: C83.2 R105.2 T10.1(S) T10.2(S) T10.5(D) T10.6(D) U19.8
AMP_VDD: C90.1 T8.1(S) T8.2(S) T8.5(D) T8.6(D) U20.8
CAL: R94.1 T6.3(G) U21.3(IDD_CAL/GPO4)
CAL_D: R95.2 T6.1(S) T6.2(S) T6.5(D) T6.6(D) T7.4(S) T9.4(S) U19.3
DCMI_PWR_EN: U21.16(GPIO6) ; port DCMI_PWR_EN
IDD_MEAS: C84.1 R102.1 U21.25(IDD_MEAS)
LCD_RST: U21.20(GPIO2) ; port LCD_RST
MFX_aGPIO1: R116.1 T5.3(G) T8.3(G) T10.3(G) U21.11(TSC_XN/GPO1)
MFX_I2C2_SCL: U21.42(I2C_SCL) ; port MFX_I2C.SCL  [project net I2C2_SCL]
MFX_I2C2_SDA: U21.43(I2C_SDA) ; port MFX_I2C.SDA  [project net I2C2_SDA]
MFX_IRQ_OUT: U21.46(IRQOUT) ; port MFX_IRQ_OUT
MFX_SWCLK: CN9.2 U21.37(SWCLK)
MFX_SWDIO: CN9.4 U21.34(SWDIO)
MFX_WAKEUP: R109.2 U21.2(WAKEUP) ; port MFX_WAKEUP
NRST: D6.2(K) ; port NRST
SH0: R84.2 T4.3(G) U21.4(IDD_SH0)
SH0_D: R85.2 T4.1(S) T4.2(S) T4.5(D) T4.6(D)
SH1: R106.2 T7.3(G) U21.5(IDD_SH1/GPO5)
SH1_D: R107.2 T7.1(S) T7.2(S) T7.5(D) T7.6(D)
SH2: R110.2 T9.3(G) U21.6(IDD_SH2/GPO6)
SH2_D: R111.2 T9.1(S) T9.2(S) T9.5(D) T9.6(D)
T50_4: JP2.1 R85.1 T5.4(S)
T50_6: R95.1 R107.1 R111.1 T5.1(S) T5.2(S) T5.5(D) T5.6(D) U19.5
USB_OTGFS_OVRCR: U21.17(GPIO7) ; port USB_OVER
uSD_Detect: U21.29(GPIO8) ; port uSD_Detect
NetC85_2: C85.2 R98.1 R101.2 U20.3
NetC88_1: C88.1 R92.1 R103.1 U20.6
NetC88_2: C88.2 R102.2 R103.2 U20.7
NetC91_1: C91.1 C94.1 L8.2 U21.9(VDDA)
NetC99_2: C99.2 D6.1(A) U21.7(NRST)
NetCN13_7: U21.19(GPIO1) ; port CTP_RST
NetJP1_1: JP1.1(COMMON) U21.22(USART_RX)
NetJP1_2: JP1.2(NO) U21.21(USART_TX)
NetR1_1: U21.40(GPIO4) ; port LED2
NetR92_2: R92.2 U19.6 U19.7
NetR96_1: R96.1 R97.1 U20.5
NetR96_2: R96.2 U19.1 U19.2
NetR97_2: R97.2 U20.1 U20.2
NetR101_1: R101.1 R105.1
NetR112_1: R112.1 U21.44(BOOT0)
NetR113_1: R113.1 U21.45(I2C_ADDR)
NetSB24_2: SB24.2 U21.41(IDD_VDD_MCU)
NetU21_39: U21.39(GPIO3) ; port USB_PWR_ON

Not connected (* = marked no-connect by the designer): U21 10(TSC_XP/GPO0)* 12(TSC_YP/GPO2)* 13(TSC_YN/GPO3)* 14(SPARE)* 15(GPIO5)* 18(GPIO0)* 26(GPIO13)* 27(GPIO14)* 28(GPIO15)* 30(GPIO9)* 31(GPIO10)* 32(GPIO11)* 33(GPIO12)* 38(IDD_SH3/GPO7)*

### Notes on the sheet
- one capacitor close to each MFX pins: VDD, VDD_1, VDD_2, VDD_3
- PC5
- PH6
- PB14
- PH4
- (near U21) Default I2C Address:1000010
- (near C90) decoupling capacitors
  close to TSZ122
- (near T6) see note *
- (near C83) decoupling capacitors
  close to TSZ122
- (near T4) see note *
- see note *
- (near T9) see note *
- differential
  amplifier
- Current direction
- Shunts
- to MCU
- bypass
- New Parts
- Title:
- Project:
- Size:
- Revision:
- Variant:
- A3
- -
- Date:
- Reference:
- Sheet:
- of
- (in symbol MFX) MFX_V3
- (in symbol TSZ122IST, part A) V+; V-

### Library data of the parts
C83 C85 C88 C90 C93 C94 C101-C103 = Cap: as C60 on sheet Camera; Published: 8-Jun-2000; Revision: July-2002: Re-released for DXP Platform.; Publisher: Altium Limited; Manuf_1: YAGEO; Manuf_Part_1: CC0603KRX7R7BB104
C84 = Cap: Capacitor,1uF,0603,16V,10%,X5R,YAGEO; Ordered by: Subcon; Published: 8-Jun-2000; Revision: July-2002: Re-released for DXP Platform.; Publisher: Altium Limited; Manuf_1: YAGEO; Manuf_Part_1: CC0603KRX5R7BB105
C91 = Cap Pol1: Tan Capacitor,1uF,10%,16V,Tan-A,TAJA105K016R; Manuf_1: AVX; Ordered by: Subcon; ECCN_US/EU: NA; Published: 8-Jun-2000; Revision: July-2002: Re-released for DXP Platform.; Publisher: Altium Limited; Manuf_Part_1: TAJA105K016R
C99 = Cap: as C3 on sheet Arduino_ Connectors; Published: 8-Jun-2000; Revision: July-2002: Re-released for DXP Platform.; Publisher: Altium Limited; Value: 100nF; Manuf_1: YAGEO
CN9 = Header 4: Header, 4-Pin; ECCN_US/EU: [N/A]; Ordered by: Subcon; Revision: 17-Jul-2002: Re-released for DXP Platform.; Publisher: Altium Limited; SOFER_FP: HDR_1X4_2R54
D6 = BAT60JFILM: Provided: STM; ECCN_US/EU: EAR99/NEC; Ref St: 9151097; Revision: July-2002: Re-released for DXP Platform.; Order: BAT60JFILM; Manuf_Part_1: BAT60JFILM; Manuf_1: STM; Distrib: ST; Ordered by: STM
JP1 = JP2: 2 PIN Jumper; Manuf_1: lyconn; Manuf_Part_1: 313102S111116; Ordered by: Subcon; Assembly: with jumper; ECCN_US/EU: [N/A]
JP2 = Jumper3: Jumper 3 pins; Manuf_1: lyconn; Manuf_Part_1: 313103S111116; Ordered by: Subcon; ECCN_US/EU: n/a
L8 = BEAD_600R_350MA_0603: Bead,600R,350mA,0603,FCM1608KF-601T03,Tai-tech; Manuf_2: TDK; Manuf_Part_2: MPZ1608S300A; Value: 100uH; Comment_1: bead,30R,5A,0603,MPZ1608S300A,TDK; Ordered by: Subcon; Revision: July-2002: Re-released for DXP Platform.; Manuf_Part_1: FCM1608KF-601T03; Order: FCM1608KF-601T03; Manuf_1: Tai-tech
R84 R94 R106 R109 R110 R116 = res1: Resistor,100K,0603,1%,YAGEO; Ordered by: Subcon; ECCN_US/EU: NA; Published: 8-Jun-2000; Revision: July-2002: Re-released for DXP Platform.; Publisher: Altium Limited; Manuf_1: YAGEO; Manuf_Part_1: RC0603FR-07100KL
R85 = Res_1_1%_0805: Resistor,1,0805,1%,YAGEO; Manuf_Part_1: RC0805FR-071RL; Value: 1; Ordered by: Subcon; Manuf_1: YAGEO; Order: RC0805FR-071RL; ECCN_US/EU: n/a
R92 R96 = res1: Resistor,6.04K,0603,1%,YAGEO; Ordered by: Subcon; ECCN_US/EU: NA; Published: 8-Jun-2000; Revision: July-2002: Re-released for DXP Platform.; Publisher: Altium Limited; Manuf_1: YAGEO; Manuf_Part_1: RC0603FR-076K04L
R95 = Res_10K_1%_0805: Resistor,10K,0805,1%,YAGEO; Manuf_Part_1: RC0805FR-0710KL; Ordered by: Subcon; Value: 10K; Manuf_1: YAGEO; Order: RC0805FR-0710KL; ECCN_US/EU: n/a
R97 R103 = res1: Resistor,300K,0603,1%,YAGEO; Ordered by: Subcon; ECCN_US/EU: NA; Published: 8-Jun-2000; Revision: July-2002: Re-released for DXP Platform.; Publisher: Altium Limited; Manuf_1: YAGEO; Manuf_Part_1: RC0603FR-07300KL
R98 = res1: Resistor,11K,0603,1%,YAGEO; Ordered by: Subcon; ECCN_US/EU: NA; Published: 8-Jun-2000; Revision: July-2002: Re-released for DXP Platform.; Publisher: Altium Limited; Manuf_1: YAGEO; Manuf_Part_1: RC0603FR-0711KL
R101 = res1: Resistor,357K,0603,1%,YAGEO; Ordered by: Subcon; ECCN_US/EU: NA; Published: 8-Jun-2000; Revision: July-2002: Re-released for DXP Platform.; Publisher: Altium Limited; Manuf_1: YAGEO; Manuf_Part_1: RC0603FR-07357KL
R102 = res1: Resistor, 100 ,0603,1%,YAGEO; Ordered by: Subcon; ECCN_US/EU: NA; Published: 8-Jun-2000; Revision: July-2002: Re-released for DXP Platform.; Publisher: Altium Limited; Manuf_1: YAGEO; Manuf_Part_1: RC0603JR-07100RL
R105 R114 = res1: Resistor, 0 ,0603,1%,YAGEO; Ordered by: Subcon; ECCN_US/EU: NA; Published: 8-Jun-2000; Revision: July-2002: Re-released for DXP Platform.; Publisher: Altium Limited; Manuf_1: YAGEO; Manuf_Part_1: RC0603JR-070RL
R107 = Res_24_1%_0805: Resistor,24,0805,1%,YAGEO; Manuf_Part_1: RC0805FR-0724RL; Value: 24; Ordered by: Subcon; Manuf_1: YAGEO; Order: RC0805FR-0724RL; ECCN_US/EU: n/a
R111 = Res_620_1%_0805: Resistor,620,0805,1%,YAGEO; Manuf_Part_1: RC0805FR-07620RL; Value: 620; Ordered by: Subcon; Manuf_1: YAGEO; Order: RC0805FR-07620RL; ECCN_US/EU: n/a
R112 = res1: Resistor,510R,0603,1%,YAGEO; Ordered by: Subcon; ECCN_US/EU: NA; Published: 8-Jun-2000; Revision: July-2002: Re-released for DXP Platform.; Publisher: Altium Limited; Manuf_1: YAGEO; Manuf_Part_1: RC0603FR-07510RL
R113 = res1: Resistor,10K,0603,1%,YAGEO; Ordered by: Subcon; ECCN_US/EU: NA; Published: 8-Jun-2000; Revision: July-2002: Re-released for DXP Platform.; Publisher: Altium Limited; Manuf_1: YAGEO; Manuf_Part_1: RC0603FR-0710KL
SB24 = SB_ON: as SB1 on sheet Arduino_ Connectors; Revision: July-2002: Re-released for DXP Platform.; ECCN_US/EU: N/A
T4-T10 = MCD-01926: 20 V, P-channel Trench MOSFET; Part_Type: IC; Part_Preference: Recommended; Manufacturer: NEXPERIA; Order_Code_RS: 153-0671; Internal_Part_Number: MCD-01926; Value: PMN30XP; Status: Checked; Manufacturer_Part_Number: PMN30XP; Alternate_Manufacturer: N/A; Alternate_Manufacturer_Part_Number: N/A; Package: TSOP6; ComponentLink1URL: http://tunmcdsvn.tun.st.com/Component_Datasheet_Library/Trunk/IC/NEXPERIA_P_Channel_MOSFET_PMN30XP; Order_Code_Digikey: 1727-2699-1-ND; Order_Code_Farnell: 2545273
U19 U20 = TSZ122IST: Very high accuracy (5 礦) zero drift 5 V dual OpAmp; Manuf_1: STM; ECCN_US/EU: EAR99/NEC; Provided: ST; Ref St: xxxxxxxxx; Manuf_Part_1: TSZ122IST; Distrib: ST; Order: TSZ122IST; Ordered by: STM
U21 = MFX: Multifunction expander; Manuf_1: STM; Manuf_Part_1: STM32L152CCT6; Ordered by: STM

## Sheet LCD.SchDoc: LCD Interface
size A3; Author: P.A.; CompanyName: STMicroelectronics; Organization: Microcontrollers Division; Address1: 12, Rue Jules HOROWITZ; Address2: 38019 Grenoble; Address3: FRANCE; DocumentNumber: MB1261; Revision: B.01; SheetNumber: 9; SheetTotal: 15; Project: STM32L496G-DISCO
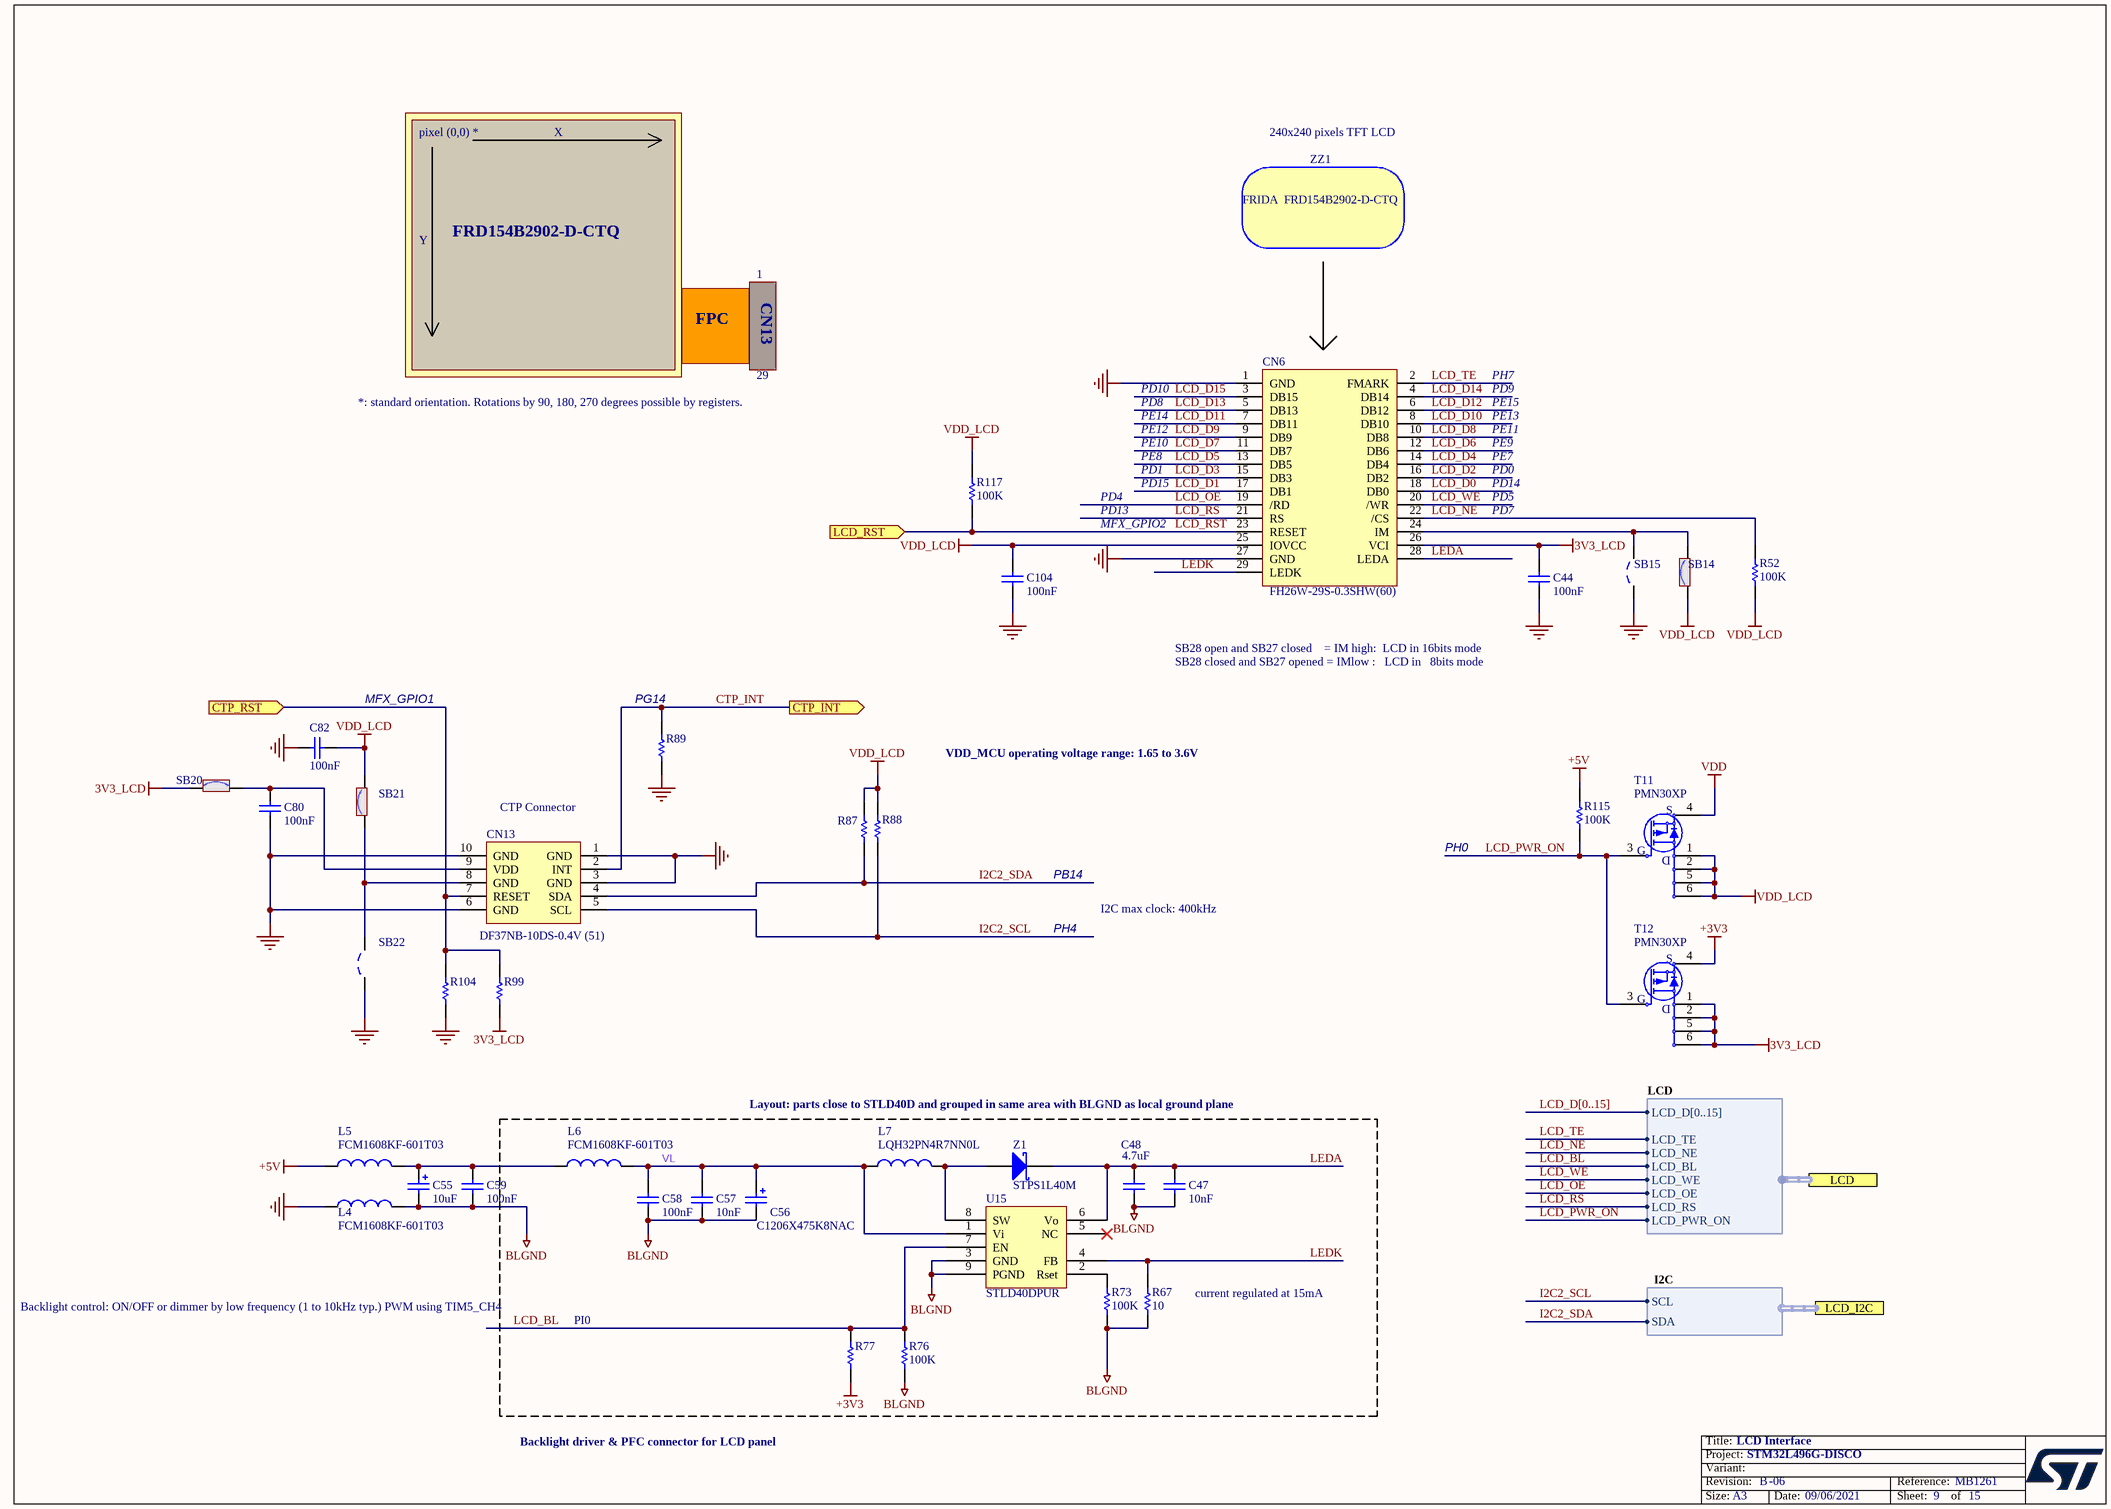
[diagram p5: LCD.SchDoc]

### Parts
C44  value 100nF  [0603C]  (hidden comment: CC0603KRX7R7BB104)
C47  value 10nF  [0603C]  (hidden comment: CC0603KRX7R9BB103)
C48  value 4.7uF  [1206C]  (hidden comment: CC1206KKX7R9BB475)
C55  value 10uF  [TAN-A]  (hidden comment: TAJA106K016R)
C56  C1206X475K8NAC  [1206C]
C57  value 10nF  [0603C]  (hidden comment: CC0603KRX7R9BB103)
C58  value 100nF  [0603C]  (hidden comment: CC0603KRX7R7BB104)
C59  value 100nF  [0603C]  (hidden comment: CC0603KRX7R7BB104)
C80  value 100nF  [0603C]  (hidden comment: CC0603KRX7R7BB104)
C82  value 100nF  [0603C]  (hidden comment: CC0603KRX7R7BB104)
C104  value 100nF  [0603C]  (hidden comment: CC0603KRX7R7BB104)
CN6  FH26W-29S-0.3SHW(60)  [FH26-29S-0R3SHW]
CN13  DF37NB-10DS-0.4V (51)  [DF37NB-10DS-0R4V]
L4  FCM1608KF-601T03  [0603L]
L5  FCM1608KF-601T03  [0603L]
L6  FCM1608KF-601T03  [0603L]
L7  LQH32PN4R7NN0L  [1210L]
R52  value 100K  [0603R]  (hidden comment: RC0603FR-07100KL)
R67  value 10  [0603R]  (hidden comment: RC0603FR-0710RL)
R73  value 100K  [0603R]  (hidden comment: RC0603FR-07100KL)
R76  value 100K  [0603R]  (hidden comment: RC0603FR-07100KL)
R77  (no value)  [0603R]
R87  (no value)  [0603R]
R88  (no value)  [0603R]
R89  (no value)  [0603R]
R99  (no value)  [0603R]
R104  (no value)  [0603R]
R115  value 100K  [0603R]  (hidden comment: RC0603FR-07100KL)
R117  value 100K  [0603R]  (hidden comment: RC0603FR-07100KL)
SB14  Solder Bridge ON  [SB_0603]  (value not drawn)
SB15  Solder Bridge OFF  [SB_0603]  (value not drawn)
SB20  Solder Bridge ON  [SB_0603]  (value not drawn)
SB21  Solder Bridge ON  [SB_0603]  (value not drawn)
SB22  Solder Bridge OFF  [SB_0603]  (value not drawn)
T11  PMN30XP  [MOS_SOT23-6L]
T12  PMN30XP  [MOS_SOT23-6L]
U15  STLD40DPUR  [SON8_0R65_3X3]
Z1  STPS1L40M  [DO-216AA]
ZZ1  FRIDA  FRD154B2902-D-CTQ  [LCD_FRD154BP2902-CTP]

### Ports
CTP_INT (out), CTP_RST (in), LCD (harness LCD), LCD_I2C (harness I2C), LCD_RST (in)

### Harnesses
LCD: LCD_NE, LCD_BL, LCD_WE, LCD_OE, LCD_D[0..15], LCD_RS, LCD_PWR_ON, LCD_TE
I2C: SDA, SCL

### Nets
3V3_LCD: C44.1 CN6.26(VCI) R99.2 SB20.1 T12.1(S) T12.2(S) T12.5(D) T12.6(D)
+3V3: R77.2 T12.4(S)  [project net 3V3_OUT]
+5V: L5.1 R115.1
BLGND: C47.2 C48.2 C55.2 C56.2 C57.2 C58.2 C59.2 L4.2 R67.2 R73.2 R76.2 U15.3(GND) U15.9(PGND)
GND: C44.2 C80.2 C82.2 C104.2 CN6.1(GND) CN6.27(GND) CN13.1(GND) CN13.3(GND) CN13.6(GND) CN13.10(GND) L4.1 R89.2 R104.2 SB15.1 SB22.1
VDD: T11.4(S)
VDD_LCD: C82.1 C104.1 CN6.25(IOVCC) R52.2 R87.2 R88.1 R117.1 SB14.1 SB21.2 T11.1(S) T11.2(S) T11.5(D) T11.6(D)
CTP_INT: CN13.2(INT) R89.1 ; port CTP_INT
I2C2_SCL: CN13.5(SCL) R88.2 ; port LCD_I2C.SCL
I2C2_SDA: CN13.4(SDA) R87.1 ; port LCD_I2C.SDA
LCD_BL: R76.1 R77.1 U15.7(EN) ; port LCD.LCD_BL
LCD_D0: CN6.18(DB0)  [project net D0]
LCD_D1: CN6.17(DB1)  [project net D1]
LCD_D2: CN6.16(DB2)  [project net D2]
LCD_D3: CN6.15(DB3)  [project net D3]
LCD_D4: CN6.14(DB4)  [project net D4]
LCD_D5: CN6.13(DB5)  [project net D5]
LCD_D6: CN6.12(DB6)  [project net D6]
LCD_D7: CN6.11(DB7)  [project net D7]
LCD_D8: CN6.10(DB8)  [project net D8]
LCD_D9: CN6.9(DB9)  [project net D9]
LCD_D10: CN6.8(DB10)  [project net D10]
LCD_D11: CN6.7(DB11)  [project net D11]
LCD_D12: CN6.6(DB12)  [project net D12]
LCD_D13: CN6.5(DB13)  [project net D13]
LCD_D14: CN6.4(DB14)  [project net D14]
LCD_D15: CN6.3(DB15)  [project net D15]
LCD_NE: CN6.22(/CS) R52.1 ; port LCD.LCD_NE
LCD_OE: CN6.19(/RD) ; port LCD.LCD_OE
LCD_PWR_ON: R115.2 T11.3(G) T12.3(G) ; port LCD.LCD_PWR_ON
LCD_RS: CN6.21(RS) ; port LCD.LCD_RS
LCD_RST: CN6.23(RESET) R117.2 ; port LCD_RST
LCD_TE: CN6.2(FMARK) ; port LCD.LCD_TE
LCD_WE: CN6.20(/WR) ; port LCD.LCD_WE
LEDA: C47.1 C48.1 CN6.28(LEDA) U15.6(Vo) Z1.2(K)
LEDK: CN6.29(LEDK) R67.1 U15.4(FB)
VL: C56.1 C57.1 C58.1 L6.2 L7.1 U15.1(Vi)
NetC55_1: C55.1 C59.1 L5.2 L6.1
NetC80_1: C80.1 CN13.9(VDD) SB20.2
NetCN6_24: CN6.24(IM) SB14.2 SB15.2
NetCN13_7: CN13.7(RESET) R99.1 R104.1 ; port CTP_RST
NetCN13_8: CN13.8(GND) SB21.1 SB22.2
NetL7_2: L7.2 U15.8(SW) Z1.1(A)
NetR73_1: R73.1 U15.2(Rset)

Not connected (* = marked no-connect by the designer): U15 5(NC)*

### Buses and harness runs
bus LCD_D[0..15]

### Notes on the sheet
- pixel (0,0) *
- X
- 240x240 pixels TFT LCD
- Y
- FRD154B2902-D-CTQ
- 1
- CN13
- FPC
- 29
- PH7
- *: standard orientation. Rotations by 90, 180, 270 degrees possible by registers.
- PE10
- PE12
- PE14
- PD8
- PD10
- PE9
- PE11
- PE13
- PE15
- PD9
- PD4
- PD13
- PD15
- PD1
- PE8
- PD7
- PD5
- PD14
- PD0
- PE7
- MFX_GPIO2
- MFX_GPIO1
- (near R89) PG14
- SB28 open and SB27 closed    = IM high:  LCD in 16bits mode
  SB28 closed and SB27 opened = IMlow :   LCD in   8bits mode
- VDD_MCU operating voltage range: 1.65 to 3.6V
- (near CN13) CTP Connector
- PH0
- PB14
- I2C max clock: 400kHz
- PH4
- Layout: parts close to STLD40D and grouped in same area with BLGND as local ground plane
- Backlight control: ON/OFF or dimmer by low frequency (1 to 10kHz typ.) PWM using TIM5_CH4
- PI0
- (near R67) current regulated at 15mA
- Backlight driver & PFC connector for LCD panel
- Title:
- Project:
- Size:
- Revision:
- Variant:
- A3
- -
- Date:
- Reference:
- Sheet:
- of

### Library data of the parts
C44 C58 C59 C80 C82 C104 = Cap: as C60 on sheet Camera; Published: 8-Jun-2000; Revision: July-2002: Re-released for DXP Platform.; Publisher: Altium Limited; Manuf_1: YAGEO; Manuf_Part_1: CC0603KRX7R7BB104
C47 C57 = Cap: Capacitor,10nF,0603,50V,10%,X7R,YAGEO;; Ordered by: Subcon; Published: 8-Jun-2000; Revision: July-2002: Re-released for DXP Platform.; Publisher: Altium Limited; Manuf_1: YAGEO; Manuf_Part_1: CC0603KRX7R9BB103
C48 = CAP: Capacitor,4.7uF,50V,X7R,10%,1206; Manuf_1: YAGEO; Ordered by: Subcon; ECCN_US/EU: NA; Published: 8-Jun-2000; Revision: July-2002: Re-released for DXP Platform.; Publisher: Altium Limited; Manuf_Part_1: CC1206KKX7R9BB475
C55 = Cap Pol1: as C61 on sheet Camera; Published: 8-Jun-2000; Revision: July-2002: Re-released for DXP Platform.; Publisher: Altium Limited; Manuf_1: AVX; Manuf_Part_1: TAJA106K016R
C56 = Cap Pol1: Capacitor,4.7uF,±10%,X7R,10V,1206,C1206X475K8NAC; Manuf_1: Kemet; Ordered by: Subcon; ECCN_US/EU: NA; Published: 8-Jun-2000; Revision: July-2002: Re-released for DXP Platform.; Publisher: Altium Limited; Value: 4.7uF; Manuf_Part_1: C1206X475K8NAC
CN6 = FH26-29S-0.3SHW: 29pins FPC connector; Manuf_1: Hirose; Ordered by: Subcon; ECCN_US/EU: NA; Manuf_Part_1: FH26W-29S-0.3SHW(60)
CN13 = Header 5X2A: Header, 5-Pin, Dual row; Manuf_1: Hirose; Ordered by: Subcon; ECCN_US/EU: NA; LatestRevisionDate: 17-Jul-2002; LatestRevisionNote: Re-released for DXP Platform.; Publisher: Altium Limited; Manuf_Part_1: DF37NB-10DS-0.4V (51)
L4-L6 = Inductor: 100uH Bead; Manuf_1: Tai-tech; Ordered by: Subcon; ECCN_US/EU: NA; Published: 8-Jun-2000; Revision: July-2002: Re-released for DXP Platform.; Publisher: Altium Limited; Value: 100uH; Manuf_Part_1: FCM1608KF-601T03
L7 = Inductor: IND,4.7uH,1A,1210,LQH32PN4R7NN0L; Manuf_1: Murata; Value: 100uH; Ordered by: Subcon; ECCN_US/EU: NA; Published: 8-Jun-2000; Revision: July-2002: Re-released for DXP Platform.; Publisher: Altium Limited; Manuf_Part_1: LQH32PN4R7NN0L
R52 R73 R76 R115 R117 = res1: as R84 on sheet IDD_measurement; Published: 8-Jun-2000; Revision: July-2002: Re-released for DXP Platform.; Publisher: Altium Limited; Manuf_1: YAGEO; Manuf_Part_1: RC0603FR-07100KL
R67 = res1: Resistor,10R,0603,1%,YAGEO; Ordered by: Subcon; ECCN_US/EU: NA; Published: 8-Jun-2000; Revision: July-2002: Re-released for DXP Platform.; Publisher: Altium Limited; Manuf_1: YAGEO; Manuf_Part_1: RC0603FR-0710RL
R77 R89 R99 R104 = res1: Resistor,100K,0603,1%,YAGEO; Manuf_Part_1: RC0603FR-07100KL; Ordered by: Subcon; ECCN_US/EU: NA; Published: 8-Jun-2000; Revision: July-2002: Re-released for DXP Platform.; Publisher: Altium Limited; Value: 100K; Manuf_1: YAGEO
R87 R88 = res1: Resistor,1.5K,0603,1%,YAGEO; Manuf_Part_1: RC0603FR-071K5L; Value: 1K5; Ordered by: Subcon; ECCN_US/EU: NA; Published: 8-Jun-2000; Revision: July-2002: Re-released for DXP Platform.; Publisher: Altium Limited; Manuf_1: YAGEO
SB14 SB20 SB21 = SB_ON: as SB1 on sheet Arduino_ Connectors; Revision: July-2002: Re-released for DXP Platform.; ECCN_US/EU: N/A
SB15 SB22 = SB_OFF: Solder: NO; Revision: July-2002: Re-released for DXP Platform.; ECCN_US/EU: N/A
T11 T12 = MCD-01926: as T4 on sheet IDD_measurement; Internal_Part_Number: MCD-01926; Value: PMN30XP; Status: Checked; Manufacturer_Part_Number: PMN30XP; Alternate_Manufacturer: N/A; Alternate_Manufacturer_Part_Number: N/A; Package: TSOP6; ComponentLink1URL: http://tunmcdsvn.tun.st.com/Component_Datasheet_Library/Trunk/IC/NEXPERIA_P_Channel_MOSFET_PMN30XP; Order_Code_Digikey: 1727-2699-1-ND; Order_Code_Farnell: 2545273
U15 = STLD40DPMR: Manuf_1: ST; Ordered by: STM; Ref St: 9176009; ECCN_US/EU: EAR99/NEC; Manuf_Part_1: STLD40DPUR
Z1 = D Schottky: Schottky Diode; Code - JEDEC: DO-214-AA; Ordered by: STM; Ref St: 9151085; ECCN_US/EU: EAR99/NEC; Published: 8-Jun-2000; Revision: July-2002: Re-released for DXP Platform.; Publisher: Altium Limited; Manuf_1: STM; Manuf_Part_1: STPS1L40M
ZZ1 = BoM_Item: Manuf_Part_1: FRIDA LCD FRD154BP2901; Ordered by: Subcon; ECCN_US/EU: EAR99/NEC; Manuf_1: FRIDA